# EAGLE design micro (EAGLE 6.3)
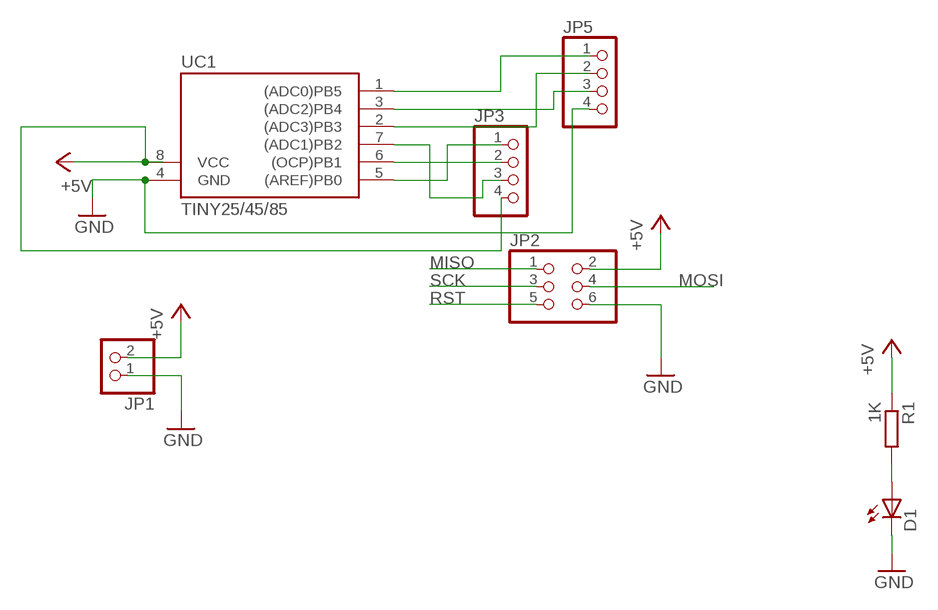
[diagram p0: schematic, sheet 1]

## Parts
D1  LED3MM  [LED3MM]
JP1  PINHD-1X02_2.54  [1X02]
JP2  PINHD-2X03_2.54  [2X03]
JP3  PINHD-1X4  [1X04]
JP5  PINHD-1X4  [1X04]
R1  1K  R-EU_0207/2V  [0207/2V]
UC1  TINY25/45/85  TINY25-20SU  [SOIC8]

## Nets
+5V: JP1.2 JP2.2 JP3.4 R1.1 UC1.8(VCC)
GND: D1.K(C) JP1.1 JP2.6 JP5.4 UC1.4(GND)
MISO: JP2.1 JP3.2 UC1.6((OCP)PB1)
MOSI: JP2.4 JP3.1 UC1.5((AREF)PB0)
N$1: JP5.2 UC1.2((ADC3)PB3)
N$2: JP5.3 UC1.3((ADC2)PB4)
N$3: D1.A R1.2
RST: JP2.5 JP5.1 UC1.1((ADC0)PB5)
SCK: JP2.3 JP3.3 UC1.7((ADC1)PB2)

## Library data of the parts
D1 = led:LED: LED OSRAM: - CHIPLED LG R971, LG N971, LY N971, LG Q971, LY Q971, LO R971, LY R971 LH N974, LH R974 LS Q976, LO Q976, LY Q976 LO Q996 - Hyper CHIPLED LW Q18S LB Q993, LB Q99A, LB R99A - SideLED LS A670, LO A670, LY A670, LG A670, LP A670 LB A673, LV A673, LT A673, LW A673 LH A674 LY A675 LS A676, LA A676, LO A676, LY A676, LW A676 LS A679, LY A679, LG A679 - Hyper Micro SIDELED® LS Y876, LA Y876, LO Y876, LY Y876 LT Y87S - SmartLED LW L88C, LW L88S LB L89C, LB L89S, LG L890 LS L89K, LO L89K, LY L89K LS L896, LA L896, LO L896, LY L896 - TOPLED LS T670, LO T670, LY T670, LG T670, LP T670 LSG T670, LSP T670, LSY T670, LOP T670, LYG T670 LG T671, LOG T671, LSG T671 LB T673, LV T673, LT T673, LW T673 LH T674 LS T676, LA T676, LO T676, LY T676, LB T676, LH T676, LSB T676, LW T676 LB T67C, LV T67C, LT T67C, LS T67K, LO T67K, LY T67K, LW E67C LS E67B, LA E67B, LO E67B, LY E67B, LB E67C, LV E67C, LT E67C LW T67C LS T679, LY T679, LG T679 LS T770, LO T770, LY T770, LG T770, LP T770 LB T773, LV T773, LT T773, LW T773 LH T774 LS E675, LA E675, LY E675, LS T675 LS T776, LA T776, LO T776, LY T776, LB T776 LHGB T686 LT T68C, LB T68C - Hyper Mini TOPLED® LB M676 - Mini TOPLED Santana® LG M470 LS M47K, LO M47K, LY M47K Source: http://www.osram.convergy.de LUXEON: - LUMILED® LXK2-PW12-R00, LXK2-PW12-S00, LXK2-PW14-U00, LXK2-PW14-V00 LXK2-PM12-R00, LXK2-PM12-S00, LXK2-PM14-U00 LXK2-PE12-Q00, LXK2-PE12-R00, LXK2-PE12-S00, LXK2-PE14-T00, LXK2-PE14-U00 LXK2-PB12-K00, LXK2-PB12-L00, LXK2-PB12-M00, LXK2-PB14-N00, LXK2-PB14-P00, LXK2-PB14-Q00 LXK2-PR12-L00, LXK2-PR12-M00, LXK2-PR14-Q00, LXK2-PR14-R00 LXK2-PD12-Q00, LXK2-PD12-R00, LXK2-PD12-S00 LXK2-PH12-R00, LXK2-PH12-S00 LXK2-PL12-P00, LXK2-PL12-Q00, LXK2-PL12-R00 Source: www.luxeon.com KINGBRIGHT: KA-3528ASYC Source: www.kingbright.com
JP1 = pinhead-2:PINHD-1X02: PIN HEADER
JP2 = pinhead-2:PINHD-2X03: PIN HEADER
JP3 JP5 = carduino:PINHD-1X4: PIN HEADER
R1 = resistor:R-EU_: RESISTOR, European symbol
UC1 = avr-5:TINY25

## Board
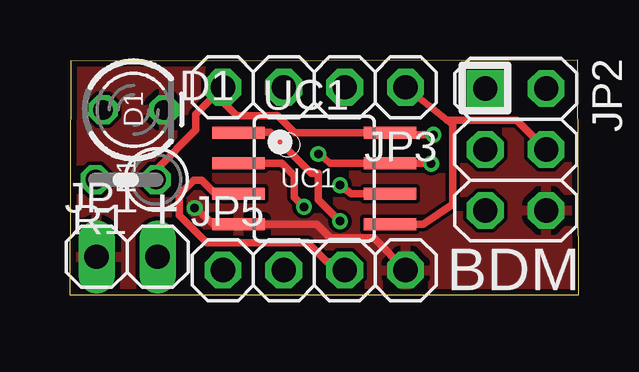
[diagram p1: board, top side]
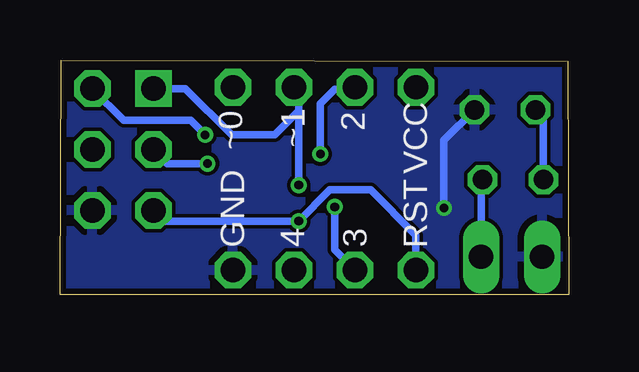
[diagram p2: board, bottom side, seen from below]

Size 21.2 x 9.77 mm. Coordinates in mm from the lower left corner, seen from the top.
Outline: 0,0 21.2,0 21.15,9.77 0.03,9.72 0,0
Copper layers (1*2*15*16): Top 0.035mm / dielectric 0.2mm / Route2 0.0175mm / dielectric 1.1mm / Route15 0.0175mm / dielectric 0.2mm / Bottom 0.035mm
Design rules "SeeedStudio_DRU_no_angle_20130527 *": minimum track width 6mil, minimum drill 14mil, track to track 6mil, track to pad 6mil, pad to pad 6mil, via to via 6mil, smd to smd 0mil, copper to edge 10mil, drill to drill 10mil, minimum pad ring 6mil, minimum via ring 6mil, stop-mask expansion 2mil, vias tented up to drill 25mil, thermal gap 10mil

### Footprints (pad centres in the part's own frame; a part is rotated, then mirrored left to right if it is on the bottom)
LED3MM = drill 0.813 octagon: A -1.27,0; K 1.27,0
1X02 = drill 1.016 long: 1 -1.27,0; 2 1.27,0
2X03 = drill 1.016 square: 1 -2.54,-1.27 | drill 1.016 octagon: 2 -2.54,1.27; 3 0,-1.27; 4 0,1.27; 5 2.54,-1.27; 6 2.54,1.27
1X04 = drill 1.016 pad 1.422 octagon: 1 -3.81,0; 2 -1.27,0; 3 1.27,0; 4 3.81,0
0207/2V = drill 0.813 octagon: 1 -1.27,0; 2 1.27,0
SOIC8 = smd 0.5 x 2.2: 1 -1.905,-3.154; 2 -0.645,-3.154; 3 0.625,-3.154; 4 1.895,-3.154; 5 1.905,3.154; 6 0.635,3.154; 7 -0.635,3.154; 8 -1.905,3.154

### Placement (x,y rotation side)
D1  2.65,7.69 0 top
JP1  2.38,1.57 0 top
JP2  18.57,6.04 270 top
JP3  10.18,8.64 180 top
JP5  10.18,1.02 0 top
R1  2.32,4.79 180 top
UC1  10.18,4.83 270 top

### Tracks (layer width: path | path; a pad name or v marks a point on that pad's centre or on a via)
+5V  (via drill 0.36)
  Top 0.305: R1.1 3.59,5.2 5.25,6.86 5.25,7.52 JP3.4 6.35,8.62 6.35,8.06 6.95,7.46 8.65,7.46 9.37,6.73 UC1.8 13.41,6.66 v15.15,6.66
  Bottom 0.305: JP1.2 3.65,4.73 R1.1 | v15.15,6.66 15.75,7.26 18.55,7.26 19.84,8.55 JP2.2
GND  (via drill 0.36)
  Top 0.305: v5.2,3.61 6.02,2.88 UC1.4 10.27,2.93 10.85,2.36 12.65,2.36 JP5.4
  Bottom 0.152: 3.83,7.37 D1.K 3.83,7.37
  Bottom 0.305: D1.K 5.2,6.42 v5.2,3.61
  pour Top: 0.05,9.76 21.25,9.76 21.25,0.06 0.05,0.06
  pour Bottom: 0.05,9.76 21.25,9.76 21.25,0.06 0.05,0.06
MISO  (via drill 0.36)
  Top 0.305: UC1.6 11.71,4.19 v11.25,4.56
  Bottom 0.305: v11.25,4.56 11.25,7.66 | 11.25,7.66 11.25,8.44 JP3.2 | JP2.1 15.97,8.58 14.05,6.66 12.25,6.66 11.25,7.66
MOSI
  Top 0.305: JP3.1 15.71,7.26 | 15.71,7.26 15.95,7.08 15.95,3.76 14.71,2.92 UC1.5 | JP2.4 18.62,7.26 15.71,7.26
N$1  (via drill 0.36)
  Top 0.305: UC1.2 8.83,5.47 9.35,4.96 9.35,4.06 v9.75,3.66
  Bottom 0.305: v9.75,3.66 9.75,1.86 JP5.2
N$2
  Top 0.305: UC1.3 6.05,4.2 5.5,4.76 5.15,4.76 4.55,4.16 4.55,3.31 5.7,2.16 9.9,2.16 10.7,1.36 11.11,1.36 JP5.3
N$3
  Bottom 0.305: R1.2 1.05,7.37 D1.A
RST  (via drill 0.36)
  Top 0.305: v11.25,3.06 10.35,3.96 10.35,5.06 10.05,5.06 8.35,6.76 7.05,6.76 UC1.1
  Bottom 0.305: JP2.5 16.86,3.06 v11.25,3.06 9.95,4.36 8.25,4.36 6.37,2.48 JP5.1
SCK  (via drill 0.36)
  Top 0.305: v15.05,5.46 v15.04,5.46 UC1.7 10.84,5.46 v10.35,5.86
  Bottom 0.305: JP2.3 16.72,5.46 v15.05,5.46 | v10.35,5.86 10.35,7.96 9.75,8.56 8.99,8.56 JP3.3

### Text on the board
_tsilk: D1 | R1 | UC1 | - | + | BDM
_bsilk: 2 | ~1 | ~0 | VCC | 3 | 4 | GND | RST